# Altium project PCB_Project.PrjPcb
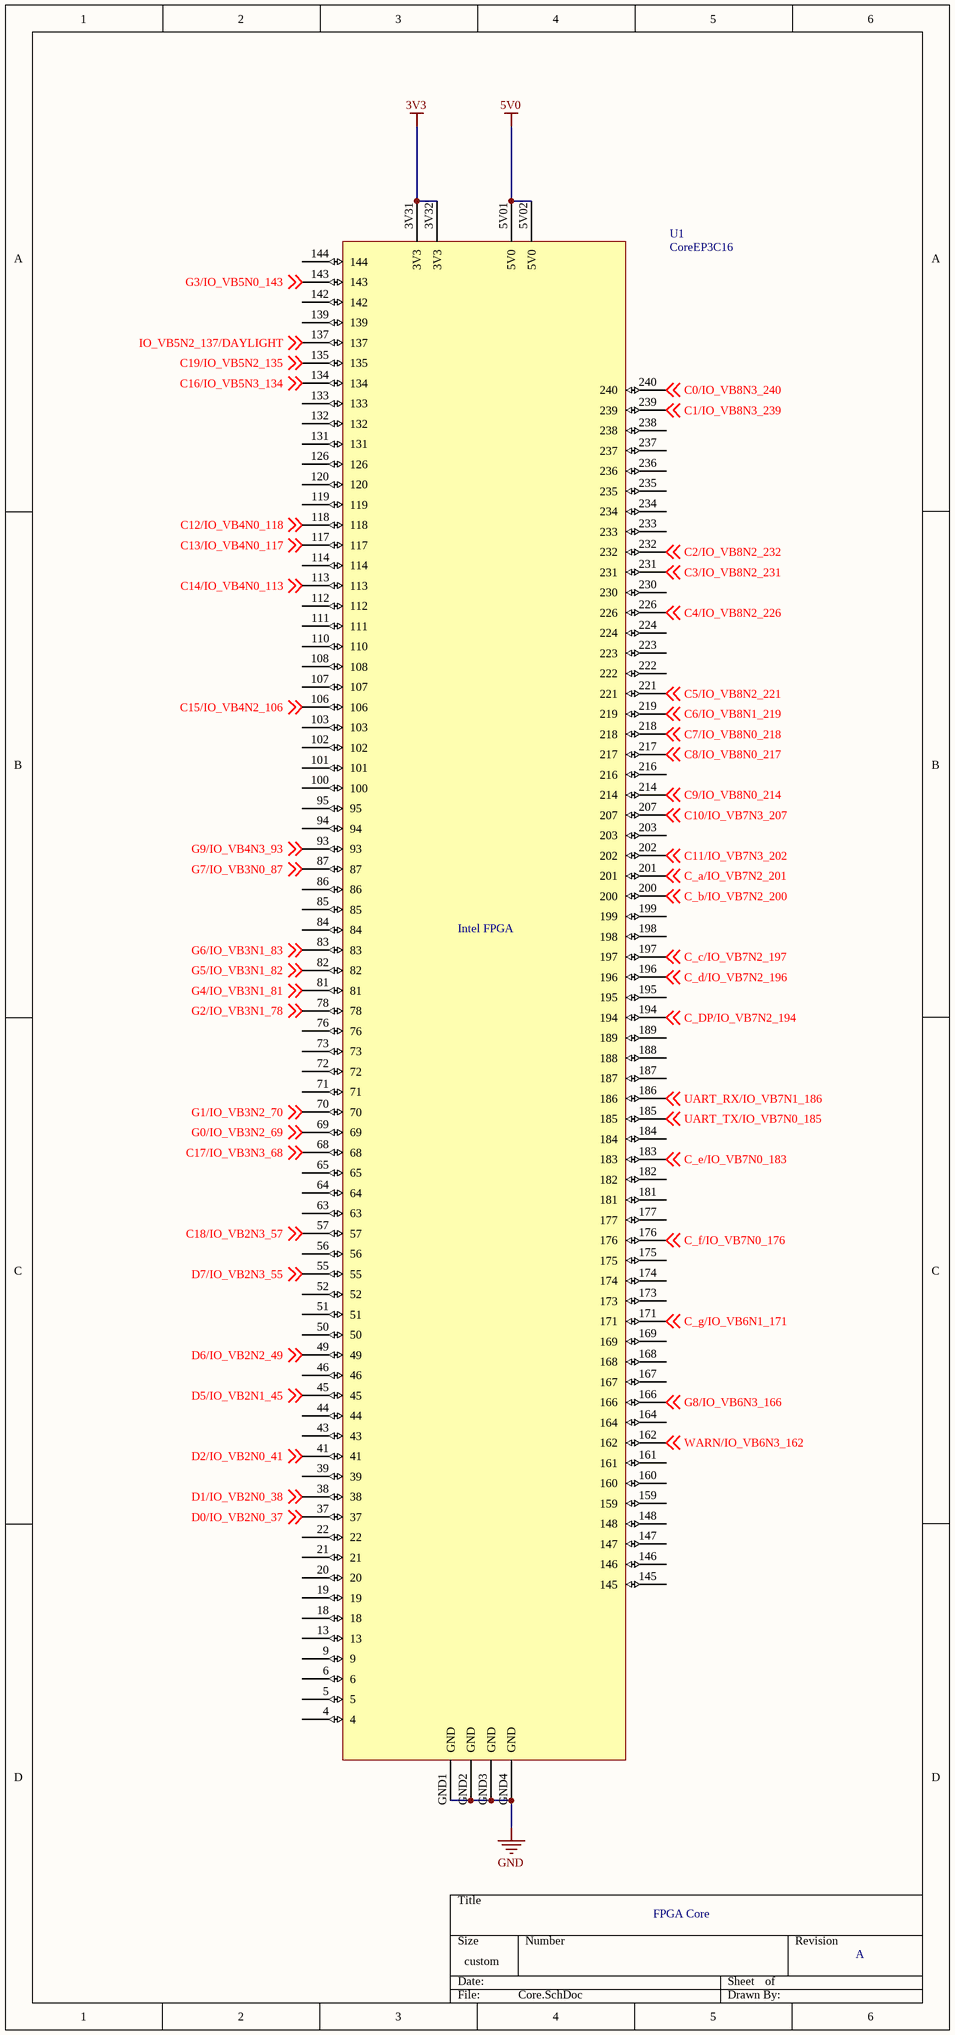
[diagram p0: Core.SchDoc]
14 sheets, 116 parts. Net scope: global (net labels, ports and power ports of the same name join across sheets).
Board files: RevB.PcbDoc, RevA.PcbDoc, RevC.PcbDoc
Sheets:
  Core.SchDoc
  Uart.SchDoc
  LED_Readout.SchDoc
  Boost_Bar.SchDoc
  AFR_bar.SchDoc
  Hole1.SchDoc
  Hole3.SchDoc
  Hole4.SchDoc
  Boost_Bar_Termination_Resistors.SchDoc
  AFR_Bar_Termination_Resistors.SchDoc
  Daylight_Sensor_Network.SchDoc
  Hole2.SchDoc
  Warning_Light.SchDoc
  LED_Readout_Termination_Resistors.SchDoc

## Sheet Core.SchDoc
size 177 x 381 mm

### Parts
U1  CoreEP3C16  [COREEP3C16]

### Nets
3V3: U1.3V31(3V3) U1.3V32(3V3)
5V0: U1.5V01(5V0) U1.5V02(5V0)
GND: U1.GND1(GND) U1.GND2(GND) U1.GND3(GND) U1.GND4(GND)
C0/IO_VB8N3_240: U1.240 ; off-sheet C0/IO_VB8N3_240
C1/IO_VB8N3_239: U1.239 ; off-sheet C1/IO_VB8N3_239
C2/IO_VB8N2_232: U1.232 ; off-sheet C2/IO_VB8N2_232
C3/IO_VB8N2_231: U1.231 ; off-sheet C3/IO_VB8N2_231
C4/IO_VB8N2_226: U1.226 ; off-sheet C4/IO_VB8N2_226
C5/IO_VB8N2_221: U1.221 ; off-sheet C5/IO_VB8N2_221
C6/IO_VB8N1_219: U1.219 ; off-sheet C6/IO_VB8N1_219
C7/IO_VB8N0_218: U1.218 ; off-sheet C7/IO_VB8N0_218
C8/IO_VB8N0_217: U1.217 ; off-sheet C8/IO_VB8N0_217
C9/IO_VB8N0_214: U1.214 ; off-sheet C9/IO_VB8N0_214
C10/IO_VB7N3_207: U1.207 ; off-sheet C10/IO_VB7N3_207
C11/IO_VB7N3_202: U1.202 ; off-sheet C11/IO_VB7N3_202
C12/IO_VB4N0_118: U1.118 ; off-sheet C12/IO_VB4N0_118
C13/IO_VB4N0_117: U1.117 ; off-sheet C13/IO_VB4N0_117
C14/IO_VB4N0_113: U1.113 ; off-sheet C14/IO_VB4N0_113
C15/IO_VB4N2_106: U1.106 ; off-sheet C15/IO_VB4N2_106
C16/IO_VB5N3_134: U1.134 ; off-sheet C16/IO_VB5N3_134
C17/IO_VB3N3_68: U1.68 ; off-sheet C17/IO_VB3N3_68
C18/IO_VB2N3_57: U1.57 ; off-sheet C18/IO_VB2N3_57
C19/IO_VB5N2_135: U1.135 ; off-sheet C19/IO_VB5N2_135
C_a/IO_VB7N2_201: U1.201 ; off-sheet C_a/IO_VB7N2_201
C_b/IO_VB7N2_200: U1.200 ; off-sheet C_b/IO_VB7N2_200
C_c/IO_VB7N2_197: U1.197 ; off-sheet C_c/IO_VB7N2_197
C_d/IO_VB7N2_196: U1.196 ; off-sheet C_d/IO_VB7N2_196
C_DP/IO_VB7N2_194: U1.194 ; off-sheet C_DP/IO_VB7N2_194
C_e/IO_VB7N0_183: U1.183 ; off-sheet C_e/IO_VB7N0_183
C_f/IO_VB7N0_176: U1.176 ; off-sheet C_f/IO_VB7N0_176
C_g/IO_VB6N1_171: U1.171 ; off-sheet C_g/IO_VB6N1_171
D0/IO_VB2N0_37: U1.37 ; off-sheet D0/IO_VB2N0_37
D1/IO_VB2N0_38: U1.38 ; off-sheet D1/IO_VB2N0_38
D2/IO_VB2N0_41: U1.41 ; off-sheet D2/IO_VB2N0_41
D5/IO_VB2N1_45: U1.45 ; off-sheet D5/IO_VB2N1_45
D6/IO_VB2N2_49: U1.49 ; off-sheet D6/IO_VB2N2_49
D7/IO_VB2N3_55: U1.55 ; off-sheet D7/IO_VB2N3_55
G0/IO_VB3N2_69: U1.69 ; off-sheet G0/IO_VB3N2_69
G1/IO_VB3N2_70: U1.70 ; off-sheet G1/IO_VB3N2_70
G2/IO_VB3N1_78: U1.78 ; off-sheet G2/IO_VB3N1_78
G3/IO_VB5N0_143: U1.143 ; off-sheet G3/IO_VB5N0_143
G4/IO_VB3N1_81: U1.81 ; off-sheet G4/IO_VB3N1_81
G5/IO_VB3N1_82: U1.82 ; off-sheet G5/IO_VB3N1_82
G6/IO_VB3N1_83: U1.83 ; off-sheet G6/IO_VB3N1_83
G7/IO_VB3N0_87: U1.87 ; off-sheet G7/IO_VB3N0_87
G8/IO_VB6N3_166: U1.166 ; off-sheet G8/IO_VB6N3_166
G9/IO_VB4N3_93: U1.93 ; off-sheet G9/IO_VB4N3_93
IO_VB5N2_137/DAYLIGHT: U1.137 ; off-sheet IO_VB5N2_137/DAYLIGHT
UART_RX/IO_VB7N1_186: U1.186 ; off-sheet UART_RX/IO_VB7N1_186
UART_TX/IO_VB7N0_185: U1.185 ; off-sheet UART_TX/IO_VB7N0_185
WARN/IO_VB6N3_162: U1.162 ; off-sheet WARN/IO_VB6N3_162

Not connected (* = marked no-connect by the designer): U1 4 5 6 9 13 18 19 20 21 22 39 43 44 46 50 51 52 56 63 64 65 71 72 73 76 84 85 86 94 95 100 101 102 103 107 108 110 111 112 114 119 120 126 131 132 133 139 142 144 145 146 147 148 159 160 161 164 167 168 169 173 174 175 177 181 182 184 187 188 189 195 198 199 203 216 222 223 224 230 233 234 235 236 237 238

### Notes on the sheet
- FPGA Core
- A
- (in symbol CoreEP3C16) Intel FPGA

### Library data of the parts
U1 = CoreEP3C16: Intel FPGA Core

## Sheet Uart.SchDoc
size A
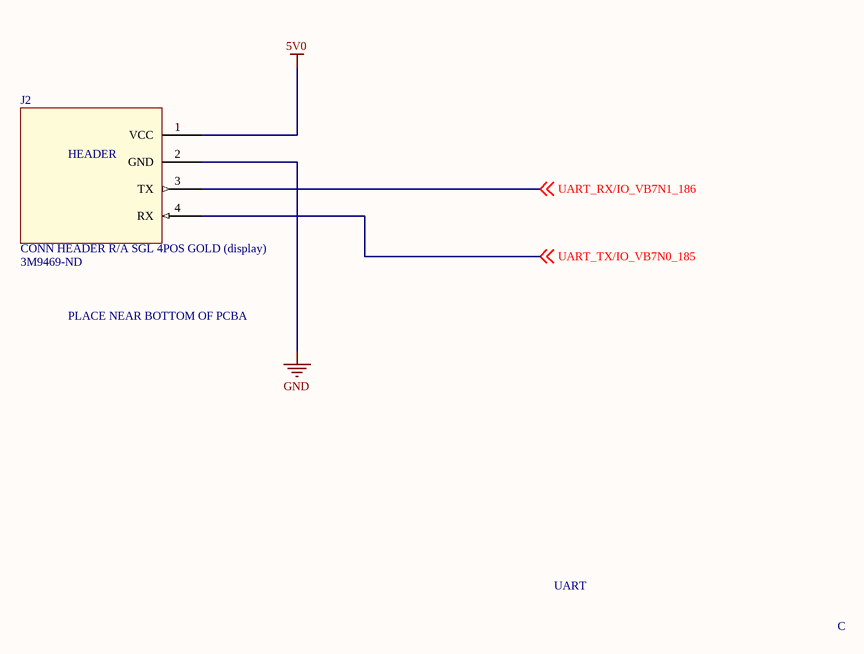
[diagram p1: Uart.SchDoc]

### Parts
J2  CONN HEADER R/A SGL 4POS GOLD (display)  Supplier Part Number 1: 3M9469-ND  [HEADER_4POS_UART]

### Nets
5V0: J2.1(VCC)
GND: J2.2(GND)
UART_RX/IO_VB7N1_186: J2.3(TX) ; off-sheet UART_RX/IO_VB7N1_186
UART_TX/IO_VB7N0_185: J2.4(RX) ; off-sheet UART_TX/IO_VB7N0_185

### Notes on the sheet
- PLACE NEAR BOTTOM OF PCBA
- UART
- C
- (in symbol CONN HEADER R/A SGL 4POS GOLD (display)) HEADER

### Library data of the parts
J2 = CONN HEADER R/A SGL 4POS GOLD (display): http://multimedia.3m.com/mws/media/548122O/3mtm-pin-strip-header-ts2182.pdf; Supplier 1: Digi-Key

## Sheet LED_Readout.SchDoc
size C
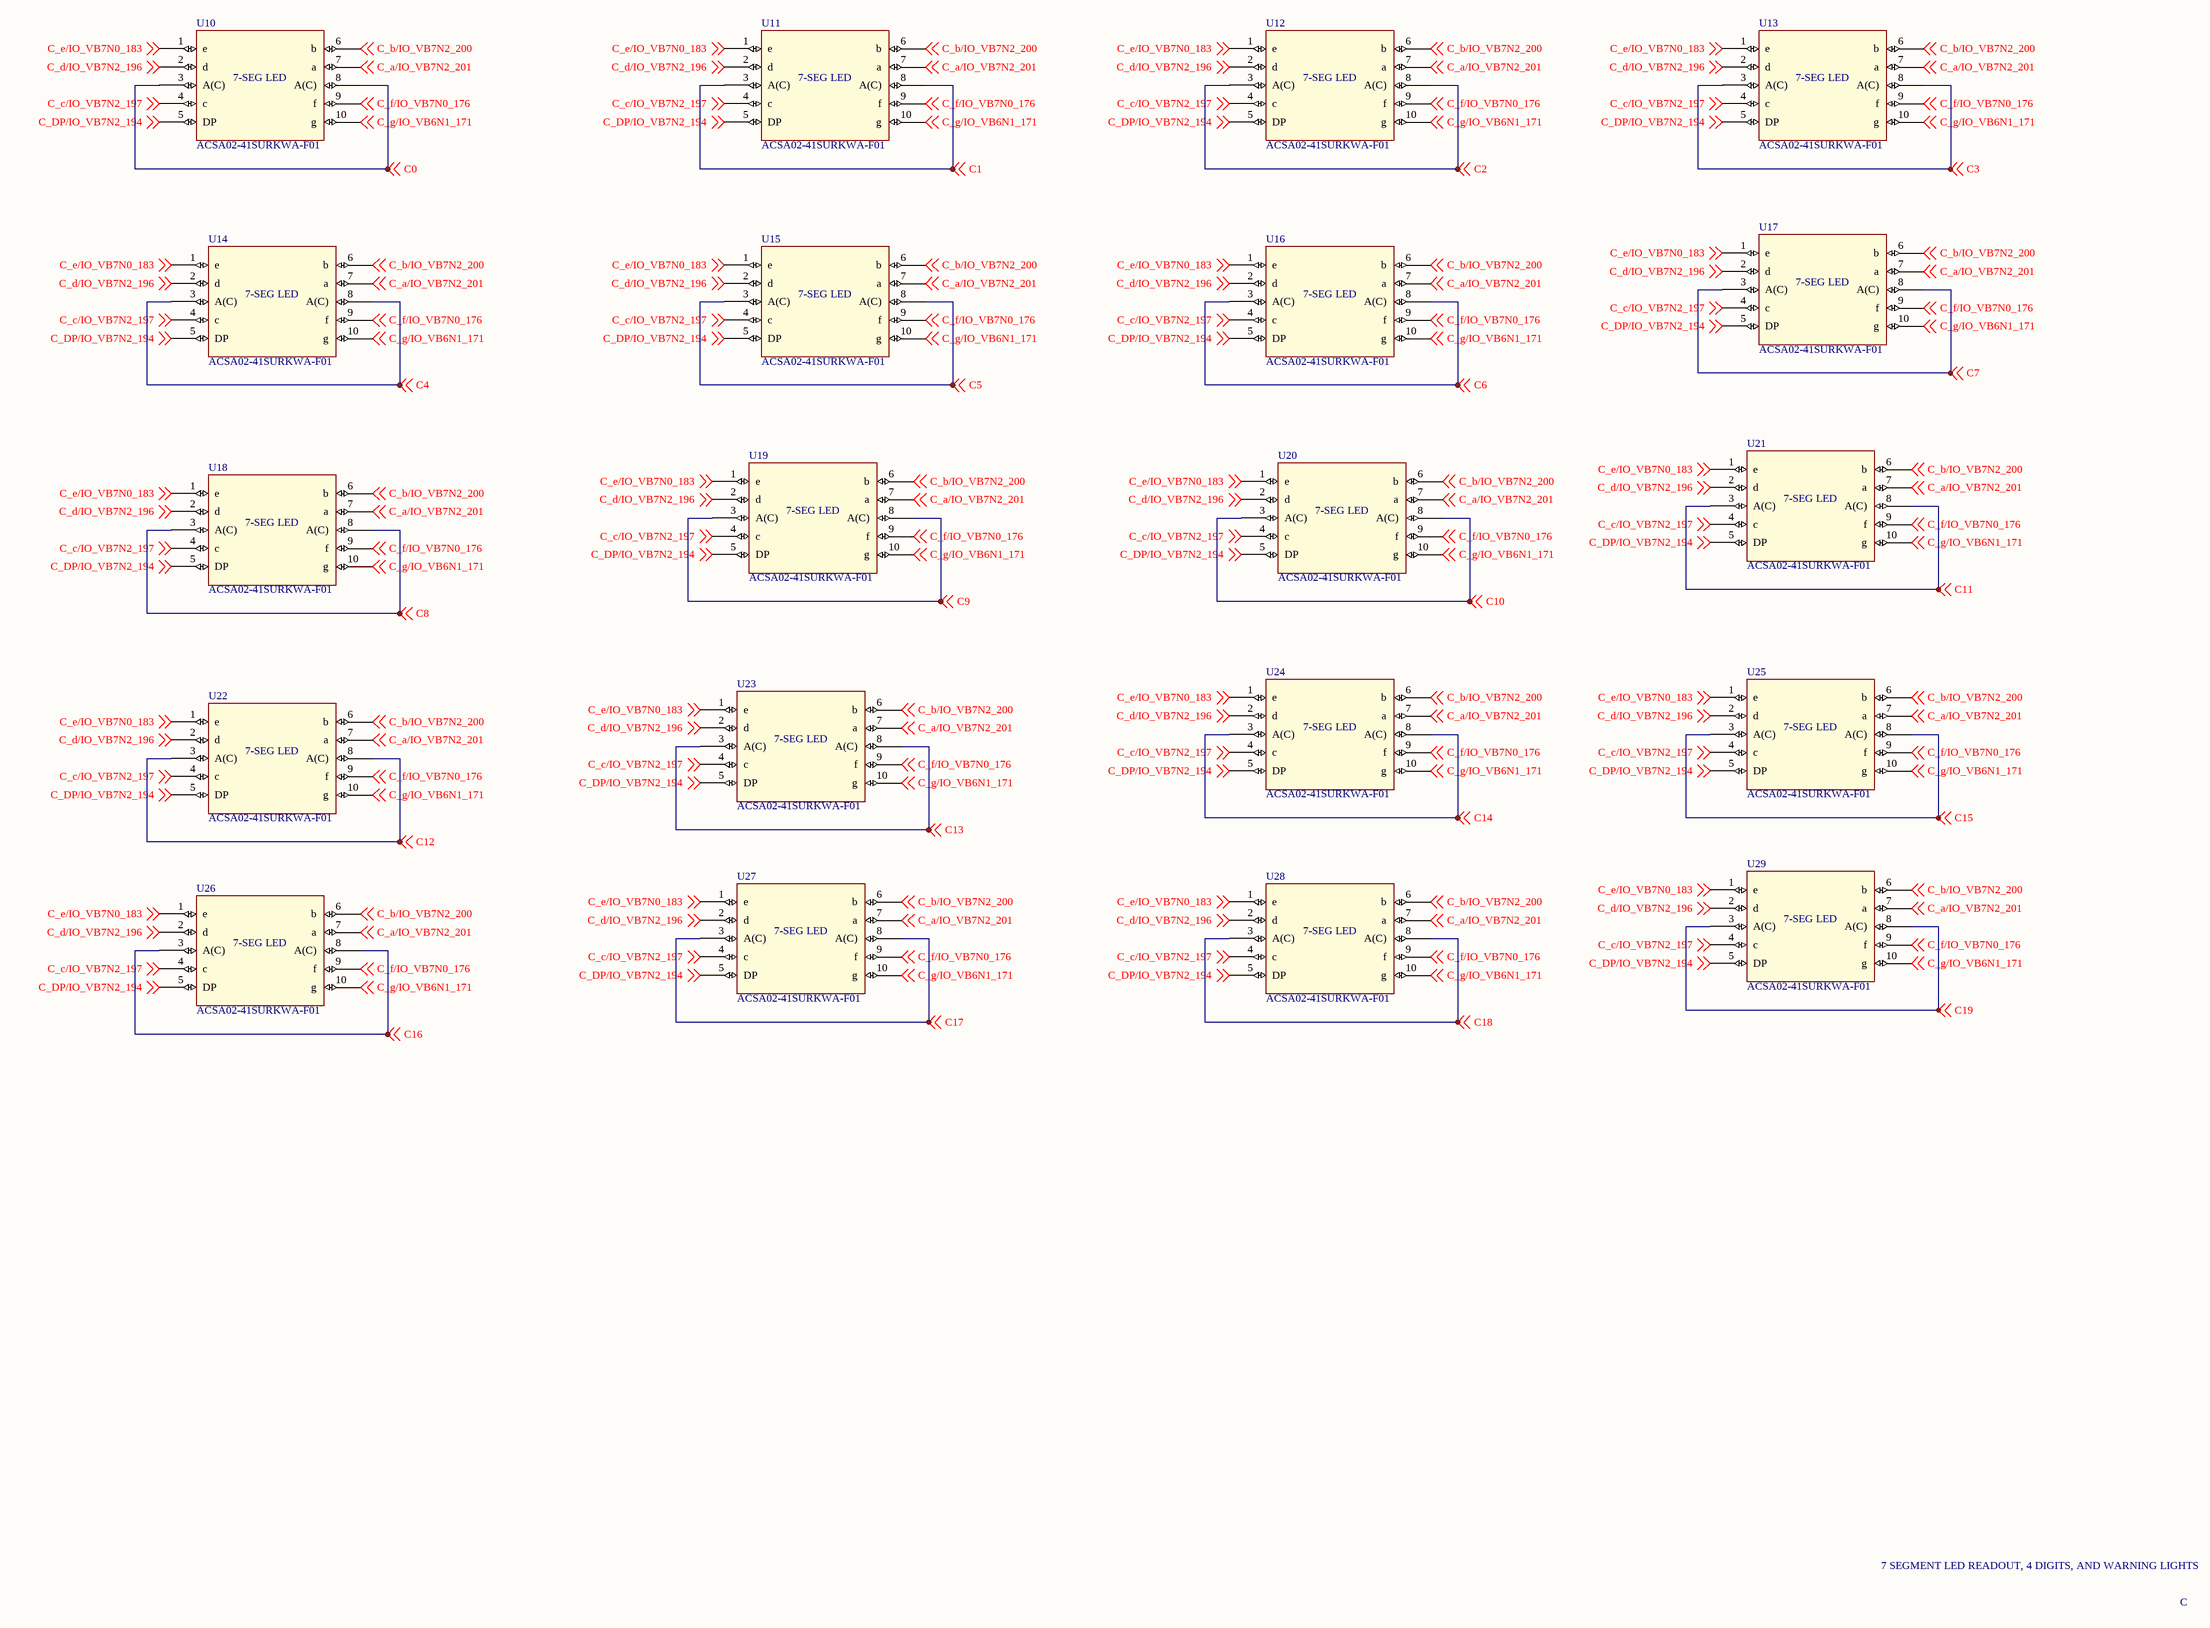
[diagram p2: LED_Readout.SchDoc]

### Parts
U10  ACSA02-41SURKWA-F01  [ACSA02-41SURKWA-F01]
U11  ACSA02-41SURKWA-F01  [ACSA02-41SURKWA-F01]
U12  ACSA02-41SURKWA-F01  [ACSA02-41SURKWA-F01]
U13  ACSA02-41SURKWA-F01  [ACSA02-41SURKWA-F01]
U14  ACSA02-41SURKWA-F01  [ACSA02-41SURKWA-F01]
U15  ACSA02-41SURKWA-F01  [ACSA02-41SURKWA-F01]
U16  ACSA02-41SURKWA-F01  [ACSA02-41SURKWA-F01]
U17  ACSA02-41SURKWA-F01  [ACSA02-41SURKWA-F01]
U18  ACSA02-41SURKWA-F01  [ACSA02-41SURKWA-F01]
U19  ACSA02-41SURKWA-F01  [ACSA02-41SURKWA-F01]
U20  ACSA02-41SURKWA-F01  [ACSA02-41SURKWA-F01]
U21  ACSA02-41SURKWA-F01  [ACSA02-41SURKWA-F01]
U22  ACSA02-41SURKWA-F01  [ACSA02-41SURKWA-F01]
U23  ACSA02-41SURKWA-F01  [ACSA02-41SURKWA-F01]
U24  ACSA02-41SURKWA-F01  [ACSA02-41SURKWA-F01]
U25  ACSA02-41SURKWA-F01  [ACSA02-41SURKWA-F01]
U26  ACSA02-41SURKWA-F01  [ACSA02-41SURKWA-F01]
U27  ACSA02-41SURKWA-F01  [ACSA02-41SURKWA-F01]
U28  ACSA02-41SURKWA-F01  [ACSA02-41SURKWA-F01]
U29  ACSA02-41SURKWA-F01  [ACSA02-41SURKWA-F01]

### Nets
C0: U10.3(A(C)) U10.8(A(C)) ; off-sheet C0
C1: U11.3(A(C)) U11.8(A(C)) ; off-sheet C1
C2: U12.3(A(C)) U12.8(A(C)) ; off-sheet C2
C3: U13.3(A(C)) U13.8(A(C)) ; off-sheet C3
C4: U14.3(A(C)) U14.8(A(C)) ; off-sheet C4
C5: U15.3(A(C)) U15.8(A(C)) ; off-sheet C5
C6: U16.3(A(C)) U16.8(A(C)) ; off-sheet C6
C7: U17.3(A(C)) U17.8(A(C)) ; off-sheet C7
C8: U18.3(A(C)) U18.8(A(C)) ; off-sheet C8
C9: U19.3(A(C)) U19.8(A(C)) ; off-sheet C9
C10: U20.3(A(C)) U20.8(A(C)) ; off-sheet C10
C11: U21.3(A(C)) U21.8(A(C)) ; off-sheet C11
C12: U22.3(A(C)) U22.8(A(C)) ; off-sheet C12
C13: U23.3(A(C)) U23.8(A(C)) ; off-sheet C13
C14: U24.3(A(C)) U24.8(A(C)) ; off-sheet C14
C15: U25.3(A(C)) U25.8(A(C)) ; off-sheet C15
C16: U26.3(A(C)) U26.8(A(C)) ; off-sheet C16
C17: U27.3(A(C)) U27.8(A(C)) ; off-sheet C17
C18: U28.3(A(C)) U28.8(A(C)) ; off-sheet C18
C19: U29.3(A(C)) U29.8(A(C)) ; off-sheet C19
C_a/IO_VB7N2_201: U10.7(a) U11.7(a) U12.7(a) U13.7(a) U14.7(a) U15.7(a) U16.7(a) U17.7(a) U18.7(a) U19.7(a) U20.7(a) U21.7(a) U22.7(a) U23.7(a) U24.7(a) U25.7(a) U26.7(a) U27.7(a) U28.7(a) U29.7(a) ; off-sheet C_a/IO_VB7N2_201
C_b/IO_VB7N2_200: U10.6(b) U11.6(b) U12.6(b) U13.6(b) U14.6(b) U15.6(b) U16.6(b) U17.6(b) U18.6(b) U19.6(b) U20.6(b) U21.6(b) U22.6(b) U23.6(b) U24.6(b) U25.6(b) U26.6(b) U27.6(b) U28.6(b) U29.6(b) ; off-sheet C_b/IO_VB7N2_200
C_c/IO_VB7N2_197: U10.4(c) U11.4(c) U12.4(c) U13.4(c) U14.4(c) U15.4(c) U16.4(c) U17.4(c) U18.4(c) U19.4(c) U20.4(c) U21.4(c) U22.4(c) U23.4(c) U24.4(c) U25.4(c) U26.4(c) U27.4(c) U28.4(c) U29.4(c) ; off-sheet C_c/IO_VB7N2_197
C_d/IO_VB7N2_196: U10.2(d) U11.2(d) U12.2(d) U13.2(d) U14.2(d) U15.2(d) U16.2(d) U17.2(d) U18.2(d) U19.2(d) U20.2(d) U21.2(d) U22.2(d) U23.2(d) U24.2(d) U25.2(d) U26.2(d) U27.2(d) U28.2(d) U29.2(d) ; off-sheet C_d/IO_VB7N2_196
C_DP/IO_VB7N2_194: U10.5(DP) U11.5(DP) U12.5(DP) U13.5(DP) U14.5(DP) U15.5(DP) U16.5(DP) U17.5(DP) U18.5(DP) U19.5(DP) U20.5(DP) U21.5(DP) U22.5(DP) U23.5(DP) U24.5(DP) U25.5(DP) U26.5(DP) U27.5(DP) U28.5(DP) U29.5(DP) ; off-sheet C_DP/IO_VB7N2_194
C_e/IO_VB7N0_183: U10.1(e) U11.1(e) U12.1(e) U13.1(e) U14.1(e) U15.1(e) U16.1(e) U17.1(e) U18.1(e) U19.1(e) U20.1(e) U21.1(e) U22.1(e) U23.1(e) U24.1(e) U25.1(e) U26.1(e) U27.1(e) U28.1(e) U29.1(e) ; off-sheet C_e/IO_VB7N0_183
C_f/IO_VB7N0_176: U10.9(f) U11.9(f) U12.9(f) U13.9(f) U14.9(f) U15.9(f) U16.9(f) U17.9(f) U18.9(f) U19.9(f) U20.9(f) U21.9(f) U22.9(f) U23.9(f) U24.9(f) U25.9(f) U26.9(f) U27.9(f) U28.9(f) U29.9(f) ; off-sheet C_f/IO_VB7N0_176
C_g/IO_VB6N1_171: U10.10(g) U11.10(g) U12.10(g) U13.10(g) U14.10(g) U15.10(g) U16.10(g) U17.10(g) U18.10(g) U19.10(g) U20.10(g) U21.10(g) U22.10(g) U23.10(g) U24.10(g) U25.10(g) U26.10(g) U27.10(g) U28.10(g) U29.10(g) ; off-sheet C_g/IO_VB6N1_171

### Notes on the sheet
- 7 SEGMENT LED READOUT, 4 DIGITS, AND WARNING LIGHTS
- C
- (in symbol ACSA02-41SURKWA-F01) 7-SEG LED

### Library data of the parts
U10-U29 = ACSA02-41SURKWA-F01: Surface Mount Display; Supplier 1: Digi-Key

## Sheet Boost_Bar.SchDoc
size B
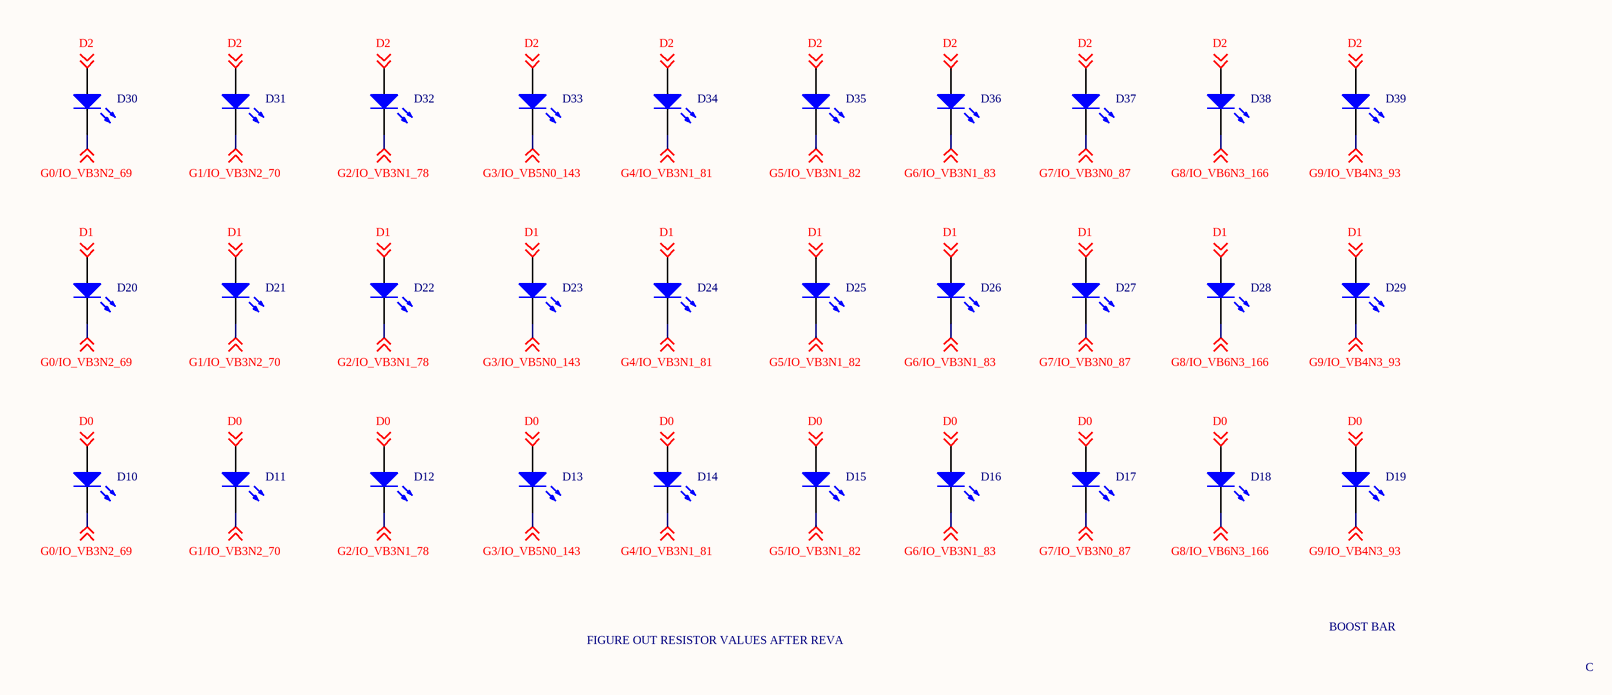
[diagram p3: Boost_Bar.SchDoc]

### Parts
D10  (no value)  [DIODE_0603]
D11  (no value)  [DIODE_0603]
D12  (no value)  [DIODE_0603]
D13  (no value)  [DIODE_0603]
D14  (no value)  [DIODE_0603]
D15  (no value)  [DIODE_0603]
D16  (no value)  [DIODE_0603]
D17  (no value)  [DIODE_0603]
D18  (no value)  [DIODE_0603]
D19  (no value)  [DIODE_0603]
D20  (no value)  [DIODE_0603]
D21  (no value)  [DIODE_0603]
D22  (no value)  [DIODE_0603]
D23  (no value)  [DIODE_0603]
D24  (no value)  [DIODE_0603]
D25  (no value)  [DIODE_0603]
D26  (no value)  [DIODE_0603]
D27  (no value)  [DIODE_0603]
D28  (no value)  [DIODE_0603]
D29  (no value)  [DIODE_0603]
D30  (no value)  [DIODE_0603]
D31  (no value)  [DIODE_0603]
D32  (no value)  [DIODE_0603]
D33  (no value)  [DIODE_0603]
D34  (no value)  [DIODE_0603]
D35  (no value)  [DIODE_0603]
D36  (no value)  [DIODE_0603]
D37  (no value)  [DIODE_0603]
D38  (no value)  [DIODE_0603]
D39  (no value)  [DIODE_0603]

### Nets
D0: D10.1(A) D11.1(A) D12.1(A) D13.1(A) D14.1(A) D15.1(A) D16.1(A) D17.1(A) D18.1(A) D19.1(A) ; off-sheet D0
D1: D20.1(A) D21.1(A) D22.1(A) D23.1(A) D24.1(A) D25.1(A) D26.1(A) D27.1(A) D28.1(A) D29.1(A) ; off-sheet D1
D2: D30.1(A) D31.1(A) D32.1(A) D33.1(A) D34.1(A) D35.1(A) D36.1(A) D37.1(A) D38.1(A) D39.1(A) ; off-sheet D2
G0/IO_VB3N2_69: D10.2(K) D20.2(K) D30.2(K) ; off-sheet G0/IO_VB3N2_69
G1/IO_VB3N2_70: D11.2(K) D21.2(K) D31.2(K) ; off-sheet G1/IO_VB3N2_70
G2/IO_VB3N1_78: D12.2(K) D22.2(K) D32.2(K) ; off-sheet G2/IO_VB3N1_78
G3/IO_VB5N0_143: D13.2(K) D23.2(K) D33.2(K) ; off-sheet G3/IO_VB5N0_143
G4/IO_VB3N1_81: D14.2(K) D24.2(K) D34.2(K) ; off-sheet G4/IO_VB3N1_81
G5/IO_VB3N1_82: D15.2(K) D25.2(K) D35.2(K) ; off-sheet G5/IO_VB3N1_82
G6/IO_VB3N1_83: D16.2(K) D26.2(K) D36.2(K) ; off-sheet G6/IO_VB3N1_83
G7/IO_VB3N0_87: D17.2(K) D27.2(K) D37.2(K) ; off-sheet G7/IO_VB3N0_87
G8/IO_VB6N3_166: D18.2(K) D28.2(K) D38.2(K) ; off-sheet G8/IO_VB6N3_166
G9/IO_VB4N3_93: D19.2(K) D29.2(K) D39.2(K) ; off-sheet G9/IO_VB4N3_93

### Notes on the sheet
- BOOST BAR
- FIGURE OUT RESISTOR VALUES AFTER REVA
- C

### Library data of the parts
D10-D39 = LED0: Typical INFRARED GaAs LED; Published: 8-Jun-2000; LatestRevisionDate: 08-Jul-2005; LatestRevisionNote: Mech Layer 1 removed.; PackageReference: LED-0; Publisher: Altium Limited; PackageDescription: LED; 2 Leads

## Sheet AFR_bar.SchDoc
size B
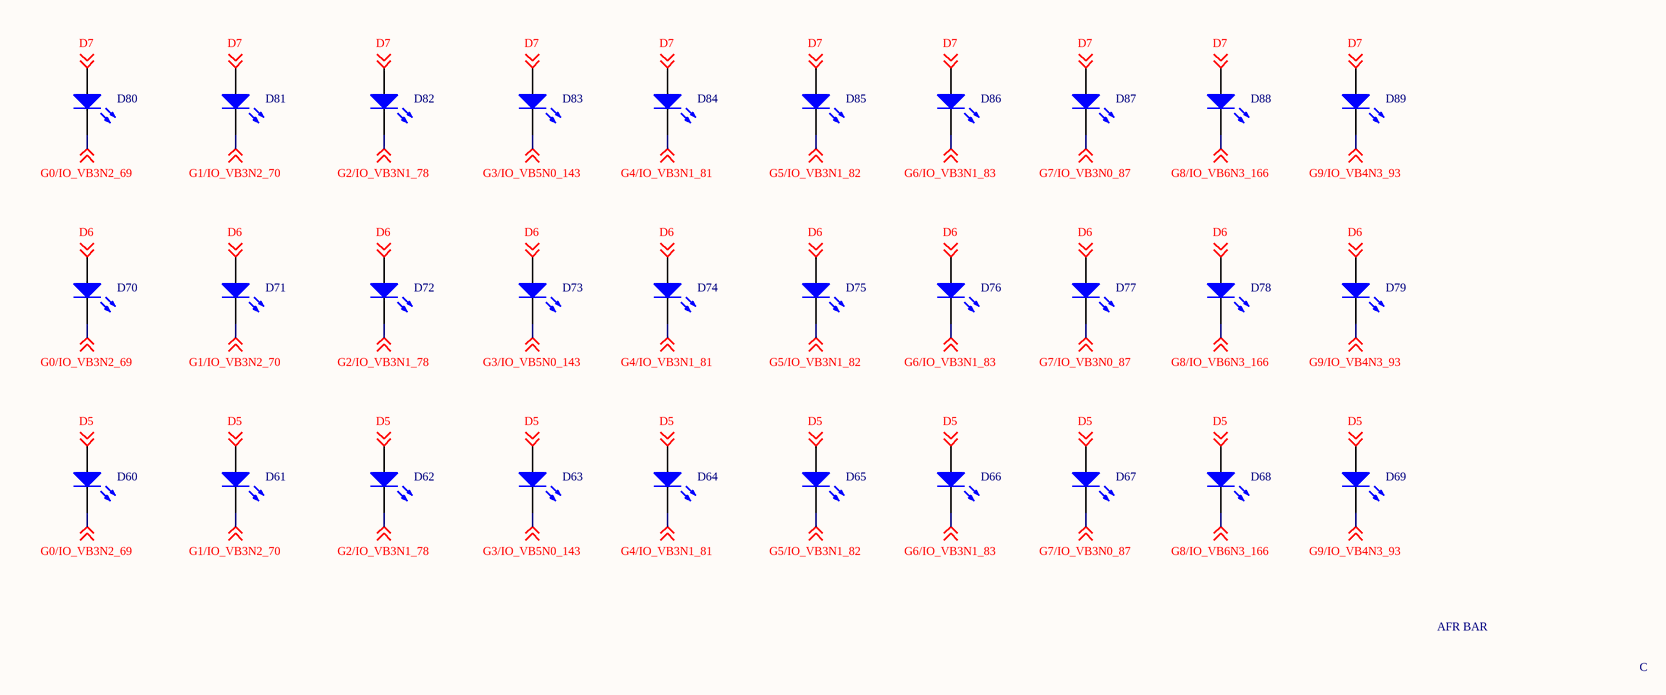
[diagram p4: AFR_bar.SchDoc]

### Parts
D60  (no value)  [DIODE_0603]
D61  (no value)  [DIODE_0603]
D62  (no value)  [DIODE_0603]
D63  (no value)  [DIODE_0603]
D64  (no value)  [DIODE_0603]
D65  (no value)  [DIODE_0603]
D66  (no value)  [DIODE_0603]
D67  (no value)  [DIODE_0603]
D68  (no value)  [DIODE_0603]
D69  (no value)  [DIODE_0603]
D70  (no value)  [DIODE_0603]
D71  (no value)  [DIODE_0603]
D72  (no value)  [DIODE_0603]
D73  (no value)  [DIODE_0603]
D74  (no value)  [DIODE_0603]
D75  (no value)  [DIODE_0603]
D76  (no value)  [DIODE_0603]
D77  (no value)  [DIODE_0603]
D78  (no value)  [DIODE_0603]
D79  (no value)  [DIODE_0603]
D80  (no value)  [DIODE_0603]
D81  (no value)  [DIODE_0603]
D82  (no value)  [DIODE_0603]
D83  (no value)  [DIODE_0603]
D84  (no value)  [DIODE_0603]
D85  (no value)  [DIODE_0603]
D86  (no value)  [DIODE_0603]
D87  (no value)  [DIODE_0603]
D88  (no value)  [DIODE_0603]
D89  (no value)  [DIODE_0603]

### Nets
D5: D60.1(A) D61.1(A) D62.1(A) D63.1(A) D64.1(A) D65.1(A) D66.1(A) D67.1(A) D68.1(A) D69.1(A) ; off-sheet D5
D6: D70.1(A) D71.1(A) D72.1(A) D73.1(A) D74.1(A) D75.1(A) D76.1(A) D77.1(A) D78.1(A) D79.1(A) ; off-sheet D6
D7: D80.1(A) D81.1(A) D82.1(A) D83.1(A) D84.1(A) D85.1(A) D86.1(A) D87.1(A) D88.1(A) D89.1(A) ; off-sheet D7
G0/IO_VB3N2_69: D60.2(K) D70.2(K) D80.2(K) ; off-sheet G0/IO_VB3N2_69
G1/IO_VB3N2_70: D61.2(K) D71.2(K) D81.2(K) ; off-sheet G1/IO_VB3N2_70
G2/IO_VB3N1_78: D62.2(K) D72.2(K) D82.2(K) ; off-sheet G2/IO_VB3N1_78
G3/IO_VB5N0_143: D63.2(K) D73.2(K) D83.2(K) ; off-sheet G3/IO_VB5N0_143
G4/IO_VB3N1_81: D64.2(K) D74.2(K) D84.2(K) ; off-sheet G4/IO_VB3N1_81
G5/IO_VB3N1_82: D65.2(K) D75.2(K) D85.2(K) ; off-sheet G5/IO_VB3N1_82
G6/IO_VB3N1_83: D66.2(K) D76.2(K) D86.2(K) ; off-sheet G6/IO_VB3N1_83
G7/IO_VB3N0_87: D67.2(K) D77.2(K) D87.2(K) ; off-sheet G7/IO_VB3N0_87
G8/IO_VB6N3_166: D68.2(K) D78.2(K) D88.2(K) ; off-sheet G8/IO_VB6N3_166
G9/IO_VB4N3_93: D69.2(K) D79.2(K) D89.2(K) ; off-sheet G9/IO_VB4N3_93

### Notes on the sheet
- AFR BAR
- C

### Library data of the parts
D60-D89 = LED0: Typical INFRARED GaAs LED; Published: 8-Jun-2000; LatestRevisionDate: 08-Jul-2005; LatestRevisionNote: Mech Layer 1 removed.; PackageReference: LED-0; Publisher: Altium Limited; PackageDescription: LED; 2 Leads

## Sheet Hole1.SchDoc
size A
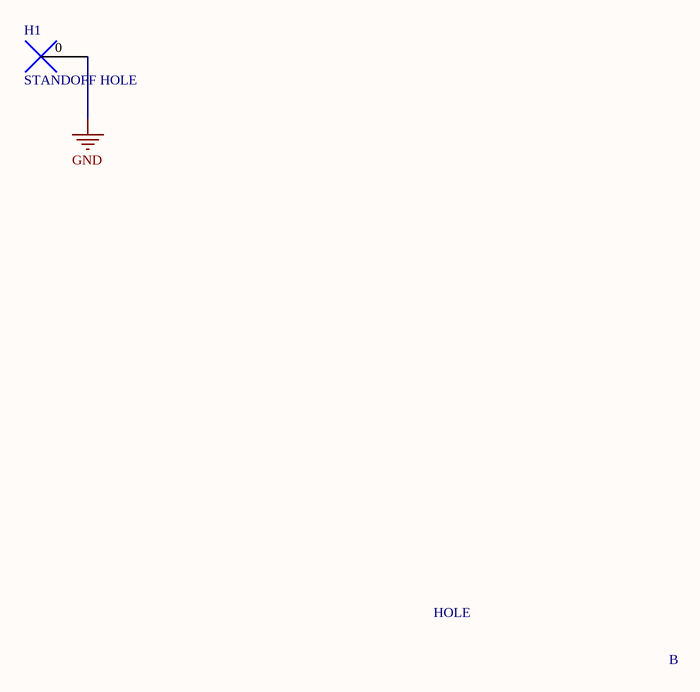
[diagram p5: Hole1.SchDoc]

### Parts
H1  STANDOFF HOLE  [HOLE_3.5MM]

### Nets
GND: H1.0

### Notes on the sheet
- HOLE
- B

## Sheet Hole3.SchDoc
size A
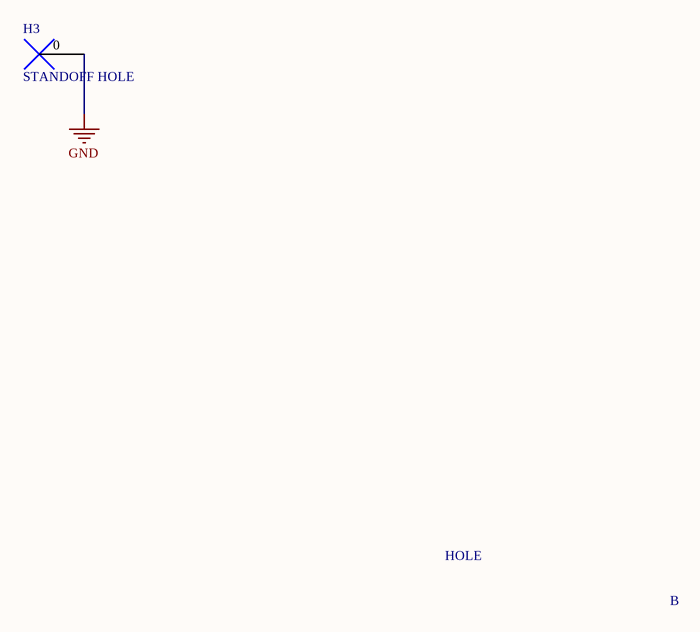
[diagram p6: Hole3.SchDoc]

### Parts
H3  STANDOFF HOLE  [HOLE_3.5MM]

### Nets
GND: H3.0

### Notes on the sheet
- HOLE
- B

## Sheet Hole4.SchDoc
size A
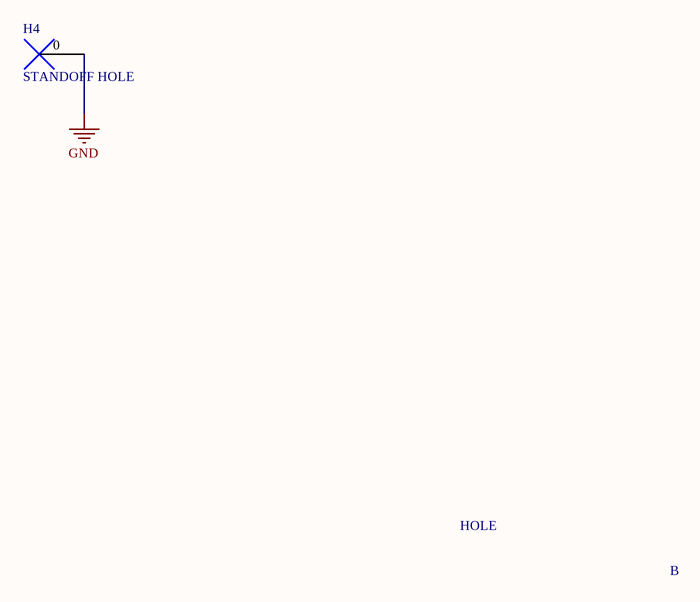
[diagram p7: Hole4.SchDoc]

### Parts
H4  STANDOFF HOLE  [HOLE_3.5MM]

### Nets
GND: H4.0

### Notes on the sheet
- HOLE
- B

## Sheet Boost_Bar_Termination_Resistors.SchDoc
size A
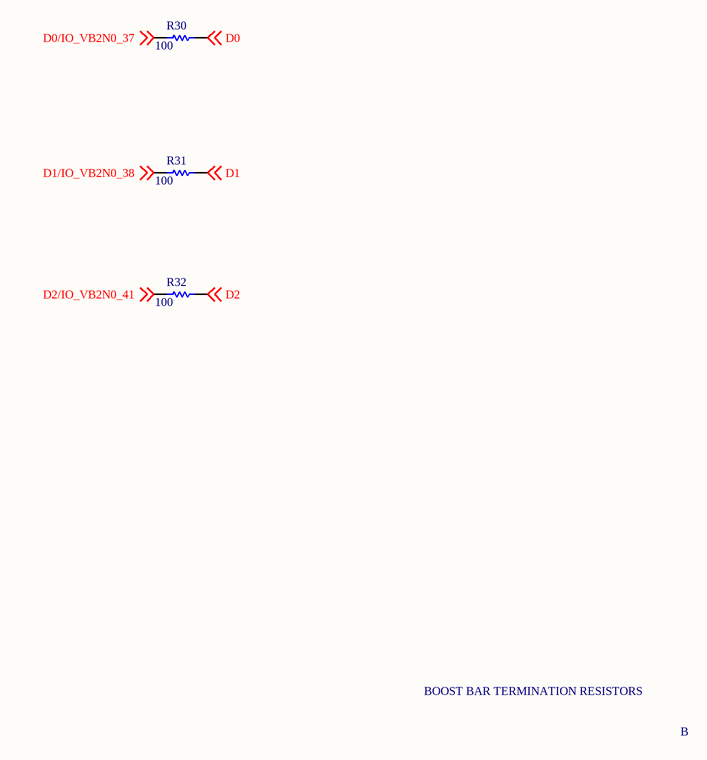
[diagram p8: Boost_Bar_Termination_Resistors.SchDoc]

### Parts
R30  value 100  [RES_0603]  (hidden comment: Figure out ohmage after RevA)
R31  value 100  [RES_0603]  (hidden comment: Figure out ohmage after RevA)
R32  value 100  [RES_0603]  (hidden comment: Figure out ohmage after RevA)

### Nets
D0: R30.2 ; off-sheet D0
D0/IO_VB2N0_37: R30.1 ; off-sheet D0/IO_VB2N0_37
D1: R31.2 ; off-sheet D1
D1/IO_VB2N0_38: R31.1 ; off-sheet D1/IO_VB2N0_38
D2: R32.2 ; off-sheet D2
D2/IO_VB2N0_41: R32.1 ; off-sheet D2/IO_VB2N0_41

### Notes on the sheet
- BOOST BAR TERMINATION RESISTORS
- B

### Library data of the parts
R30-R32 = Res1: Resistor; Published: 8-Jun-2000; LatestRevisionDate: 17-Jul-2002; LatestRevisionNote: Re-released for DXP Platform.; PackageReference: AXIAL-0.3; Publisher: Altium Limited; PackageDescription: Axial Device, Thru-Hole; 2 Leads; 0.3 in Pin Spacing

## Sheet AFR_Bar_Termination_Resistors.SchDoc
size A
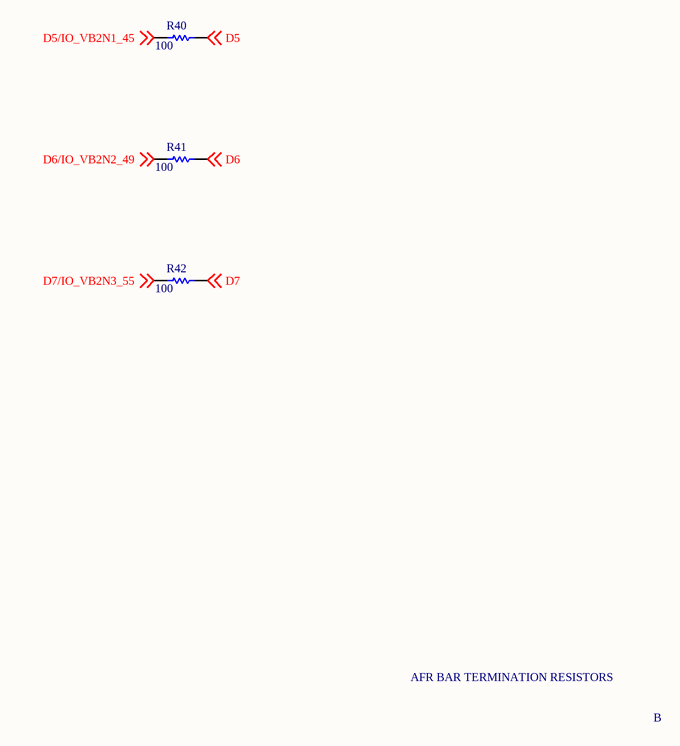
[diagram p9: AFR_Bar_Termination_Resistors.SchDoc]

### Parts
R40  value 100  [RES_0603]  (hidden comment: Figure out ohmage after RevA)
R41  value 100  [RES_0603]  (hidden comment: Figure out ohmage after RevA)
R42  value 100  [RES_0603]  (hidden comment: Figure out ohmage after RevA)

### Nets
D5: R40.2 ; off-sheet D5
D5/IO_VB2N1_45: R40.1 ; off-sheet D5/IO_VB2N1_45
D6: R41.2 ; off-sheet D6
D6/IO_VB2N2_49: R41.1 ; off-sheet D6/IO_VB2N2_49
D7: R42.2 ; off-sheet D7
D7/IO_VB2N3_55: R42.1 ; off-sheet D7/IO_VB2N3_55

### Notes on the sheet
- AFR BAR TERMINATION RESISTORS
- B

### Library data of the parts
R40-R42 = Res1: Resistor; Published: 8-Jun-2000; LatestRevisionDate: 17-Jul-2002; LatestRevisionNote: Re-released for DXP Platform.; PackageReference: AXIAL-0.3; Publisher: Altium Limited; PackageDescription: Axial Device, Thru-Hole; 2 Leads; 0.3 in Pin Spacing

## Sheet Daylight_Sensor_Network.SchDoc
size A
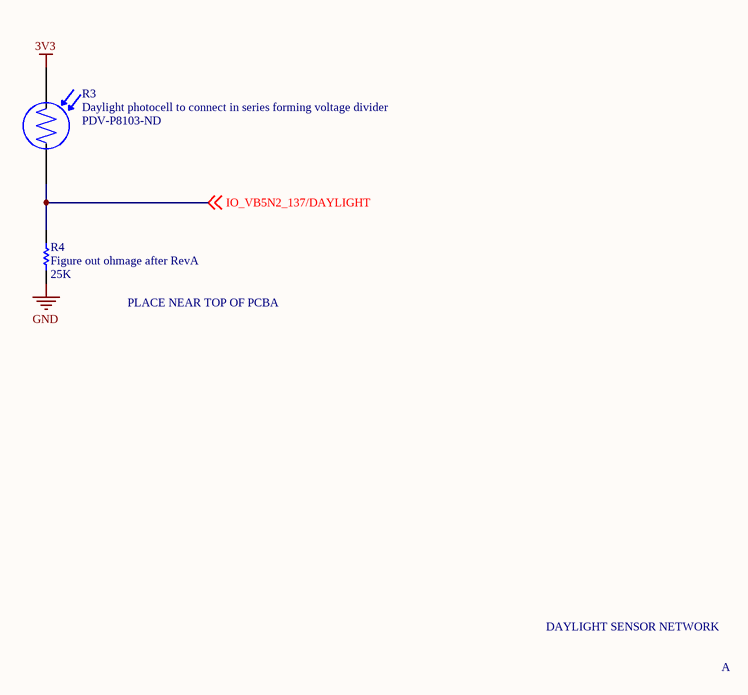
[diagram p10: Daylight_Sensor_Network.SchDoc]

### Parts
R3  Daylight photocell to connect in series forming voltage divider  Supplier Part Number 1: PDV-P8103-ND  [RES_NSL-19M51]
R4  Figure out ohmage after RevA  value 25K  [RES_0603]

### Nets
3V3: R3.1
GND: R4.1
IO_VB5N2_137/DAYLIGHT: R3.2 R4.2 ; off-sheet IO_VB5N2_137/DAYLIGHT

### Notes on the sheet
- PLACE NEAR TOP OF PCBA
- DAYLIGHT SENSOR NETWORK
- A

### Library data of the parts
R3 = PHOTOCELL 16-33KOHM: http://media.digikey.com/pdf/Data%20Sheets/Photonic%20Detetectors%20Inc%20PDFs/PDV-P8103.pdf; Supplier 1: Digi-Key
R4 = Res1: Resistor; Published: 8-Jun-2000; LatestRevisionDate: 17-Jul-2002; LatestRevisionNote: Re-released for DXP Platform.; PackageReference: AXIAL-0.3; Publisher: Altium Limited; PackageDescription: Axial Device, Thru-Hole; 2 Leads; 0.3 in Pin Spacing

## Sheet Hole2.SchDoc
size A
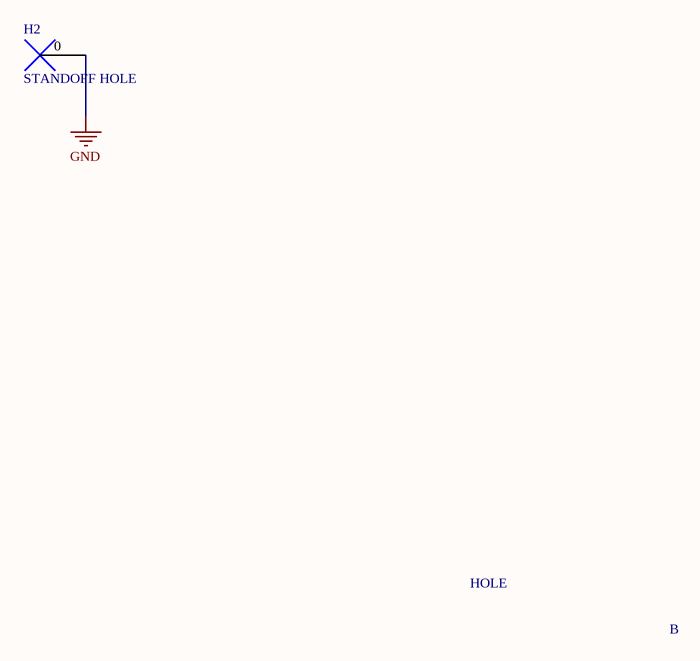
[diagram p11: Hole2.SchDoc]

### Parts
H2  STANDOFF HOLE  [HOLE_3.5MM]

### Nets
GND: H2.0

### Notes on the sheet
- HOLE
- B

## Sheet Warning_Light.SchDoc
size A
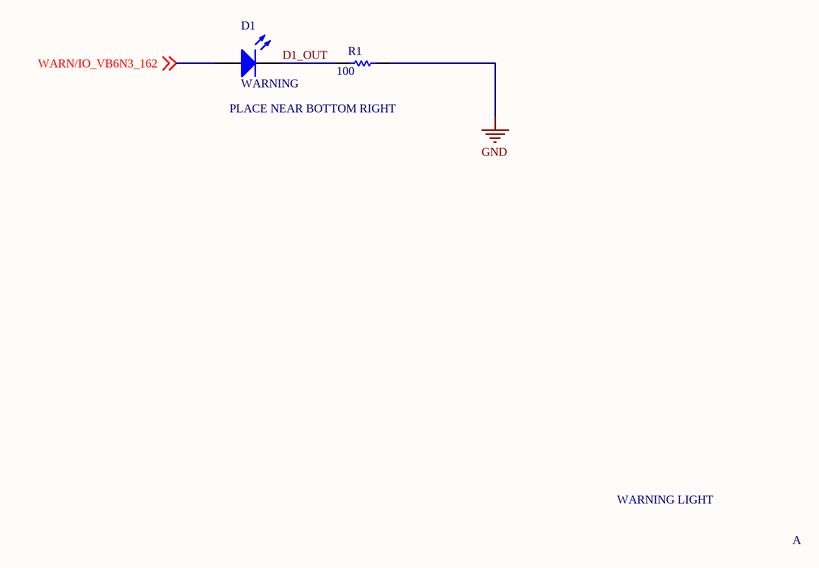
[diagram p12: Warning_Light.SchDoc]

### Parts
D1  WARNING  [DIODE_0603]
R1  value 100  [RES_0603]  (hidden comment: Figure out ohmage after RevA)

### Nets
GND: R1.2
D1_OUT: D1.2(K) R1.1
WARN/IO_VB6N3_162: D1.1(A) ; off-sheet WARN/IO_VB6N3_162

### Notes on the sheet
- PLACE NEAR BOTTOM RIGHT
- WARNING LIGHT
- A

### Library data of the parts
D1 = LED0: Typical INFRARED GaAs LED; Published: 8-Jun-2000; LatestRevisionDate: 08-Jul-2005; LatestRevisionNote: Mech Layer 1 removed.; PackageReference: LED-0; Publisher: Altium Limited; PackageDescription: LED; 2 Leads
R1 = Res1: Resistor; Published: 8-Jun-2000; LatestRevisionDate: 17-Jul-2002; LatestRevisionNote: Re-released for DXP Platform.; PackageReference: AXIAL-0.3; Publisher: Altium Limited; PackageDescription: Axial Device, Thru-Hole; 2 Leads; 0.3 in Pin Spacing

## Sheet LED_Readout_Termination_Resistors.SchDoc
size A
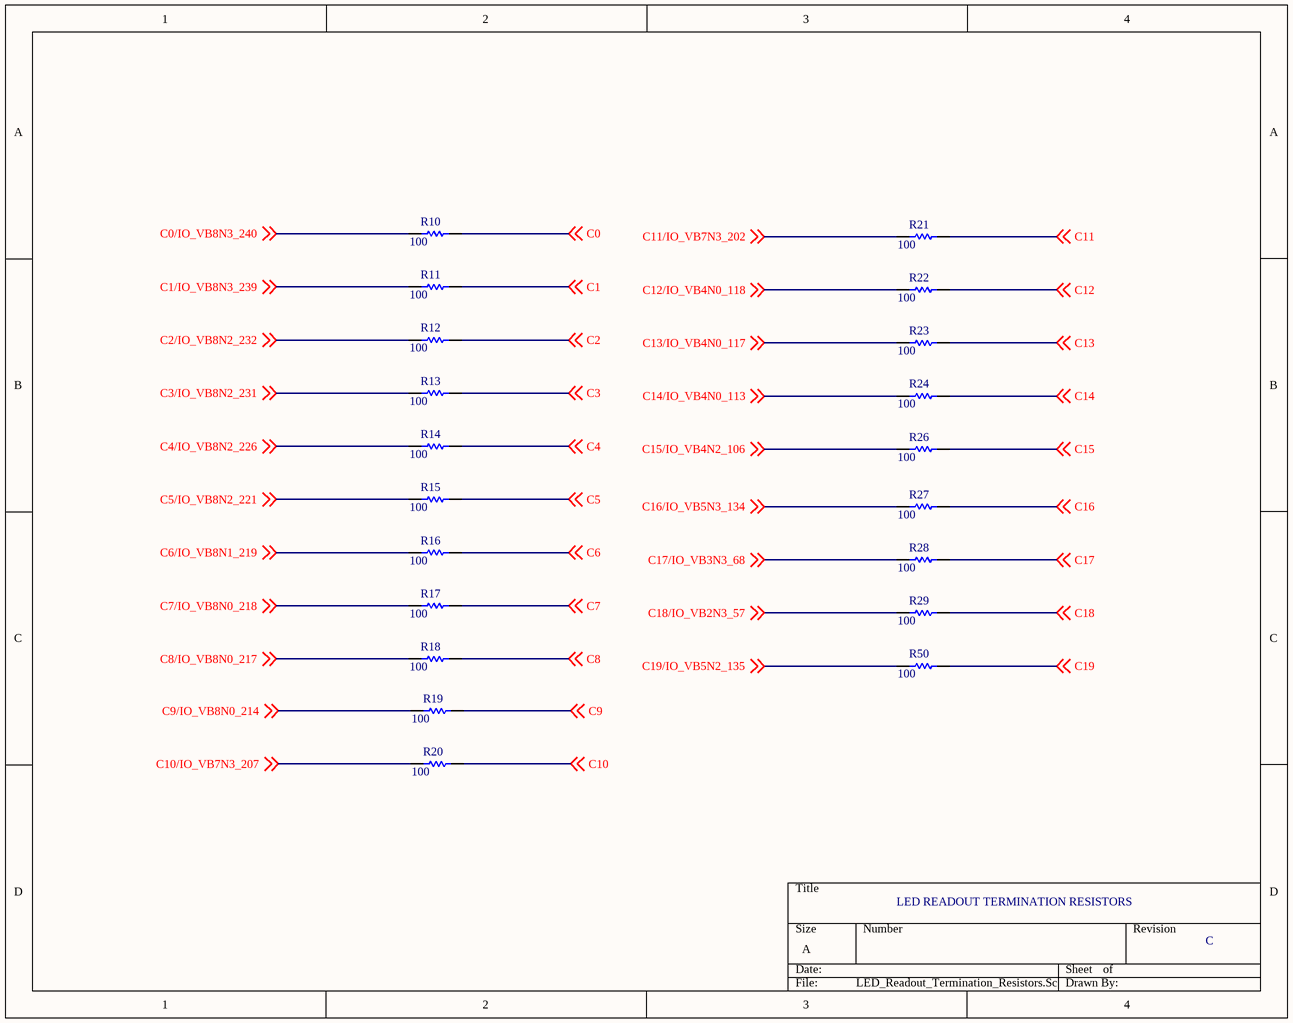
[diagram p13: LED_Readout_Termination_Resistors.SchDoc]

### Parts
R10  value 100  [RES_0603]  (hidden comment: Figure out ohmage after RevA)
R11  value 100  [RES_0603]  (hidden comment: Figure out ohmage after RevA)
R12  value 100  [RES_0603]  (hidden comment: Figure out ohmage after RevA)
R13  value 100  [RES_0603]  (hidden comment: Figure out ohmage after RevA)
R14  value 100  [RES_0603]  (hidden comment: Figure out ohmage after RevA)
R15  value 100  [RES_0603]  (hidden comment: Figure out ohmage after RevA)
R16  value 100  [RES_0603]  (hidden comment: Figure out ohmage after RevA)
R17  value 100  [RES_0603]  (hidden comment: Figure out ohmage after RevA)
R18  value 100  [RES_0603]  (hidden comment: Figure out ohmage after RevA)
R19  value 100  [RES_0603]  (hidden comment: Figure out ohmage after RevA)
R20  value 100  [RES_0603]  (hidden comment: Figure out ohmage after RevA)
R21  value 100  [RES_0603]  (hidden comment: Figure out ohmage after RevA)
R22  value 100  [RES_0603]  (hidden comment: Figure out ohmage after RevA)
R23  value 100  [RES_0603]  (hidden comment: Figure out ohmage after RevA)
R24  value 100  [RES_0603]  (hidden comment: Figure out ohmage after RevA)
R26  value 100  [RES_0603]  (hidden comment: Figure out ohmage after RevA)
R27  value 100  [RES_0603]  (hidden comment: Figure out ohmage after RevA)
R28  value 100  [RES_0603]  (hidden comment: Figure out ohmage after RevA)
R29  value 100  [RES_0603]  (hidden comment: Figure out ohmage after RevA)
R50  value 100  [RES_0603]  (hidden comment: Figure out ohmage after RevA)

### Nets
C0: R10.2 ; off-sheet C0
C0/IO_VB8N3_240: R10.1 ; off-sheet C0/IO_VB8N3_240
C1: R11.2 ; off-sheet C1
C1/IO_VB8N3_239: R11.1 ; off-sheet C1/IO_VB8N3_239
C2: R12.2 ; off-sheet C2
C2/IO_VB8N2_232: R12.1 ; off-sheet C2/IO_VB8N2_232
C3: R13.2 ; off-sheet C3
C3/IO_VB8N2_231: R13.1 ; off-sheet C3/IO_VB8N2_231
C4: R14.2 ; off-sheet C4
C4/IO_VB8N2_226: R14.1 ; off-sheet C4/IO_VB8N2_226
C5: R15.2 ; off-sheet C5
C5/IO_VB8N2_221: R15.1 ; off-sheet C5/IO_VB8N2_221
C6: R16.2 ; off-sheet C6
C6/IO_VB8N1_219: R16.1 ; off-sheet C6/IO_VB8N1_219
C7: R17.2 ; off-sheet C7
C7/IO_VB8N0_218: R17.1 ; off-sheet C7/IO_VB8N0_218
C8: R18.2 ; off-sheet C8
C8/IO_VB8N0_217: R18.1 ; off-sheet C8/IO_VB8N0_217
C9: R19.2 ; off-sheet C9
C9/IO_VB8N0_214: R19.1 ; off-sheet C9/IO_VB8N0_214
C10: R20.2 ; off-sheet C10
C10/IO_VB7N3_207: R20.1 ; off-sheet C10/IO_VB7N3_207
C11: R21.2 ; off-sheet C11
C11/IO_VB7N3_202: R21.1 ; off-sheet C11/IO_VB7N3_202
C12: R22.2 ; off-sheet C12
C12/IO_VB4N0_118: R22.1 ; off-sheet C12/IO_VB4N0_118
C13: R23.2 ; off-sheet C13
C13/IO_VB4N0_117: R23.1 ; off-sheet C13/IO_VB4N0_117
C14: R24.2 ; off-sheet C14
C14/IO_VB4N0_113: R24.1 ; off-sheet C14/IO_VB4N0_113
C15: R26.2 ; off-sheet C15
C15/IO_VB4N2_106: R26.1 ; off-sheet C15/IO_VB4N2_106
C16: R27.2 ; off-sheet C16
C16/IO_VB5N3_134: R27.1 ; off-sheet C16/IO_VB5N3_134
C17: R28.2 ; off-sheet C17
C17/IO_VB3N3_68: R28.1 ; off-sheet C17/IO_VB3N3_68
C18: R29.2 ; off-sheet C18
C18/IO_VB2N3_57: R29.1 ; off-sheet C18/IO_VB2N3_57
C19: R50.2 ; off-sheet C19
C19/IO_VB5N2_135: R50.1 ; off-sheet C19/IO_VB5N2_135

### Notes on the sheet
- LED READOUT TERMINATION RESISTORS
- C

### Library data of the parts
R10-R24 R26-R29 R50 = Res1: Resistor; Published: 8-Jun-2000; LatestRevisionDate: 17-Jul-2002; LatestRevisionNote: Re-released for DXP Platform.; PackageReference: AXIAL-0.3; Publisher: Altium Limited; PackageDescription: Axial Device, Thru-Hole; 2 Leads; 0.3 in Pin Spacing

## Nets that join several sheets
3V3: Core (U1.3V31 U1.3V32), Daylight_Sensor_Network (R3.1)
5V0: Core (U1.5V01 U1.5V02), Uart (J2.1)
GND: Core (U1.GND1 U1.GND2 U1.GND3 U1.GND4), Uart (J2.2), Hole1 (H1.0), Hole3 (H3.0), Hole4 (H4.0), Daylight_Sensor_Network (R4.1), Hole2 (H2.0), Warning_Light (R1.2)
C0: LED_Readout (U10.3 U10.8), LED_Readout_Termination_Resistors (R10.2)
C0/IO_VB8N3_240: Core (U1.240), LED_Readout_Termination_Resistors (R10.1)
C1: LED_Readout (U11.3 U11.8), LED_Readout_Termination_Resistors (R11.2)
C1/IO_VB8N3_239: Core (U1.239), LED_Readout_Termination_Resistors (R11.1)
C2: LED_Readout (U12.3 U12.8), LED_Readout_Termination_Resistors (R12.2)
C2/IO_VB8N2_232: Core (U1.232), LED_Readout_Termination_Resistors (R12.1)
C3: LED_Readout (U13.3 U13.8), LED_Readout_Termination_Resistors (R13.2)
C3/IO_VB8N2_231: Core (U1.231), LED_Readout_Termination_Resistors (R13.1)
C4: LED_Readout (U14.3 U14.8), LED_Readout_Termination_Resistors (R14.2)
C4/IO_VB8N2_226: Core (U1.226), LED_Readout_Termination_Resistors (R14.1)
C5: LED_Readout (U15.3 U15.8), LED_Readout_Termination_Resistors (R15.2)
C5/IO_VB8N2_221: Core (U1.221), LED_Readout_Termination_Resistors (R15.1)
C6: LED_Readout (U16.3 U16.8), LED_Readout_Termination_Resistors (R16.2)
C6/IO_VB8N1_219: Core (U1.219), LED_Readout_Termination_Resistors (R16.1)
C7: LED_Readout (U17.3 U17.8), LED_Readout_Termination_Resistors (R17.2)
C7/IO_VB8N0_218: Core (U1.218), LED_Readout_Termination_Resistors (R17.1)
C8: LED_Readout (U18.3 U18.8), LED_Readout_Termination_Resistors (R18.2)
C8/IO_VB8N0_217: Core (U1.217), LED_Readout_Termination_Resistors (R18.1)
C9: LED_Readout (U19.3 U19.8), LED_Readout_Termination_Resistors (R19.2)
C9/IO_VB8N0_214: Core (U1.214), LED_Readout_Termination_Resistors (R19.1)
C10: LED_Readout (U20.3 U20.8), LED_Readout_Termination_Resistors (R20.2)
C10/IO_VB7N3_207: Core (U1.207), LED_Readout_Termination_Resistors (R20.1)
C11: LED_Readout (U21.3 U21.8), LED_Readout_Termination_Resistors (R21.2)
C11/IO_VB7N3_202: Core (U1.202), LED_Readout_Termination_Resistors (R21.1)
C12: LED_Readout (U22.3 U22.8), LED_Readout_Termination_Resistors (R22.2)
C12/IO_VB4N0_118: Core (U1.118), LED_Readout_Termination_Resistors (R22.1)
C13: LED_Readout (U23.3 U23.8), LED_Readout_Termination_Resistors (R23.2)
C13/IO_VB4N0_117: Core (U1.117), LED_Readout_Termination_Resistors (R23.1)
C14: LED_Readout (U24.3 U24.8), LED_Readout_Termination_Resistors (R24.2)
C14/IO_VB4N0_113: Core (U1.113), LED_Readout_Termination_Resistors (R24.1)
C15: LED_Readout (U25.3 U25.8), LED_Readout_Termination_Resistors (R26.2)
C15/IO_VB4N2_106: Core (U1.106), LED_Readout_Termination_Resistors (R26.1)
C16: LED_Readout (U26.3 U26.8), LED_Readout_Termination_Resistors (R27.2)
C16/IO_VB5N3_134: Core (U1.134), LED_Readout_Termination_Resistors (R27.1)
C17: LED_Readout (U27.3 U27.8), LED_Readout_Termination_Resistors (R28.2)
C17/IO_VB3N3_68: Core (U1.68), LED_Readout_Termination_Resistors (R28.1)
C18: LED_Readout (U28.3 U28.8), LED_Readout_Termination_Resistors (R29.2)
C18/IO_VB2N3_57: Core (U1.57), LED_Readout_Termination_Resistors (R29.1)
C19: LED_Readout (U29.3 U29.8), LED_Readout_Termination_Resistors (R50.2)
C19/IO_VB5N2_135: Core (U1.135), LED_Readout_Termination_Resistors (R50.1)
C_a/IO_VB7N2_201: Core (U1.201), LED_Readout (20 pins)
C_b/IO_VB7N2_200: Core (U1.200), LED_Readout (20 pins)
C_c/IO_VB7N2_197: Core (U1.197), LED_Readout (20 pins)
C_d/IO_VB7N2_196: Core (U1.196), LED_Readout (20 pins)
C_DP/IO_VB7N2_194: Core (U1.194), LED_Readout (20 pins)
C_e/IO_VB7N0_183: Core (U1.183), LED_Readout (20 pins)
C_f/IO_VB7N0_176: Core (U1.176), LED_Readout (20 pins)
C_g/IO_VB6N1_171: Core (U1.171), LED_Readout (20 pins)
D0: Boost_Bar (10 pins), Boost_Bar_Termination_Resistors (R30.2)
D0/IO_VB2N0_37: Core (U1.37), Boost_Bar_Termination_Resistors (R30.1)
D1: Boost_Bar (10 pins), Boost_Bar_Termination_Resistors (R31.2)
D1/IO_VB2N0_38: Core (U1.38), Boost_Bar_Termination_Resistors (R31.1)
D2: Boost_Bar (10 pins), Boost_Bar_Termination_Resistors (R32.2)
D2/IO_VB2N0_41: Core (U1.41), Boost_Bar_Termination_Resistors (R32.1)
D5: AFR_bar (10 pins), AFR_Bar_Termination_Resistors (R40.2)
D5/IO_VB2N1_45: Core (U1.45), AFR_Bar_Termination_Resistors (R40.1)
D6: AFR_bar (10 pins), AFR_Bar_Termination_Resistors (R41.2)
D6/IO_VB2N2_49: Core (U1.49), AFR_Bar_Termination_Resistors (R41.1)
D7: AFR_bar (10 pins), AFR_Bar_Termination_Resistors (R42.2)
D7/IO_VB2N3_55: Core (U1.55), AFR_Bar_Termination_Resistors (R42.1)
G0/IO_VB3N2_69: Core (U1.69), Boost_Bar (D10.2 D20.2 D30.2), AFR_bar (D60.2 D70.2 D80.2)
G1/IO_VB3N2_70: Core (U1.70), Boost_Bar (D11.2 D21.2 D31.2), AFR_bar (D61.2 D71.2 D81.2)
G2/IO_VB3N1_78: Core (U1.78), Boost_Bar (D12.2 D22.2 D32.2), AFR_bar (D62.2 D72.2 D82.2)
G3/IO_VB5N0_143: Core (U1.143), Boost_Bar (D13.2 D23.2 D33.2), AFR_bar (D63.2 D73.2 D83.2)
G4/IO_VB3N1_81: Core (U1.81), Boost_Bar (D14.2 D24.2 D34.2), AFR_bar (D64.2 D74.2 D84.2)
G5/IO_VB3N1_82: Core (U1.82), Boost_Bar (D15.2 D25.2 D35.2), AFR_bar (D65.2 D75.2 D85.2)
G6/IO_VB3N1_83: Core (U1.83), Boost_Bar (D16.2 D26.2 D36.2), AFR_bar (D66.2 D76.2 D86.2)
G7/IO_VB3N0_87: Core (U1.87), Boost_Bar (D17.2 D27.2 D37.2), AFR_bar (D67.2 D77.2 D87.2)
G8/IO_VB6N3_166: Core (U1.166), Boost_Bar (D18.2 D28.2 D38.2), AFR_bar (D68.2 D78.2 D88.2)
G9/IO_VB4N3_93: Core (U1.93), Boost_Bar (D19.2 D29.2 D39.2), AFR_bar (D69.2 D79.2 D89.2)
IO_VB5N2_137/DAYLIGHT: Core (U1.137), Daylight_Sensor_Network (R3.2 R4.2)
UART_RX/IO_VB7N1_186: Core (U1.186), Uart (J2.3)
UART_TX/IO_VB7N0_185: Core (U1.185), Uart (J2.4)
WARN/IO_VB6N3_162: Core (U1.162), Warning_Light (D1.1)